# EAGLE design pb-led-matrix (EAGLE 7.2.0)
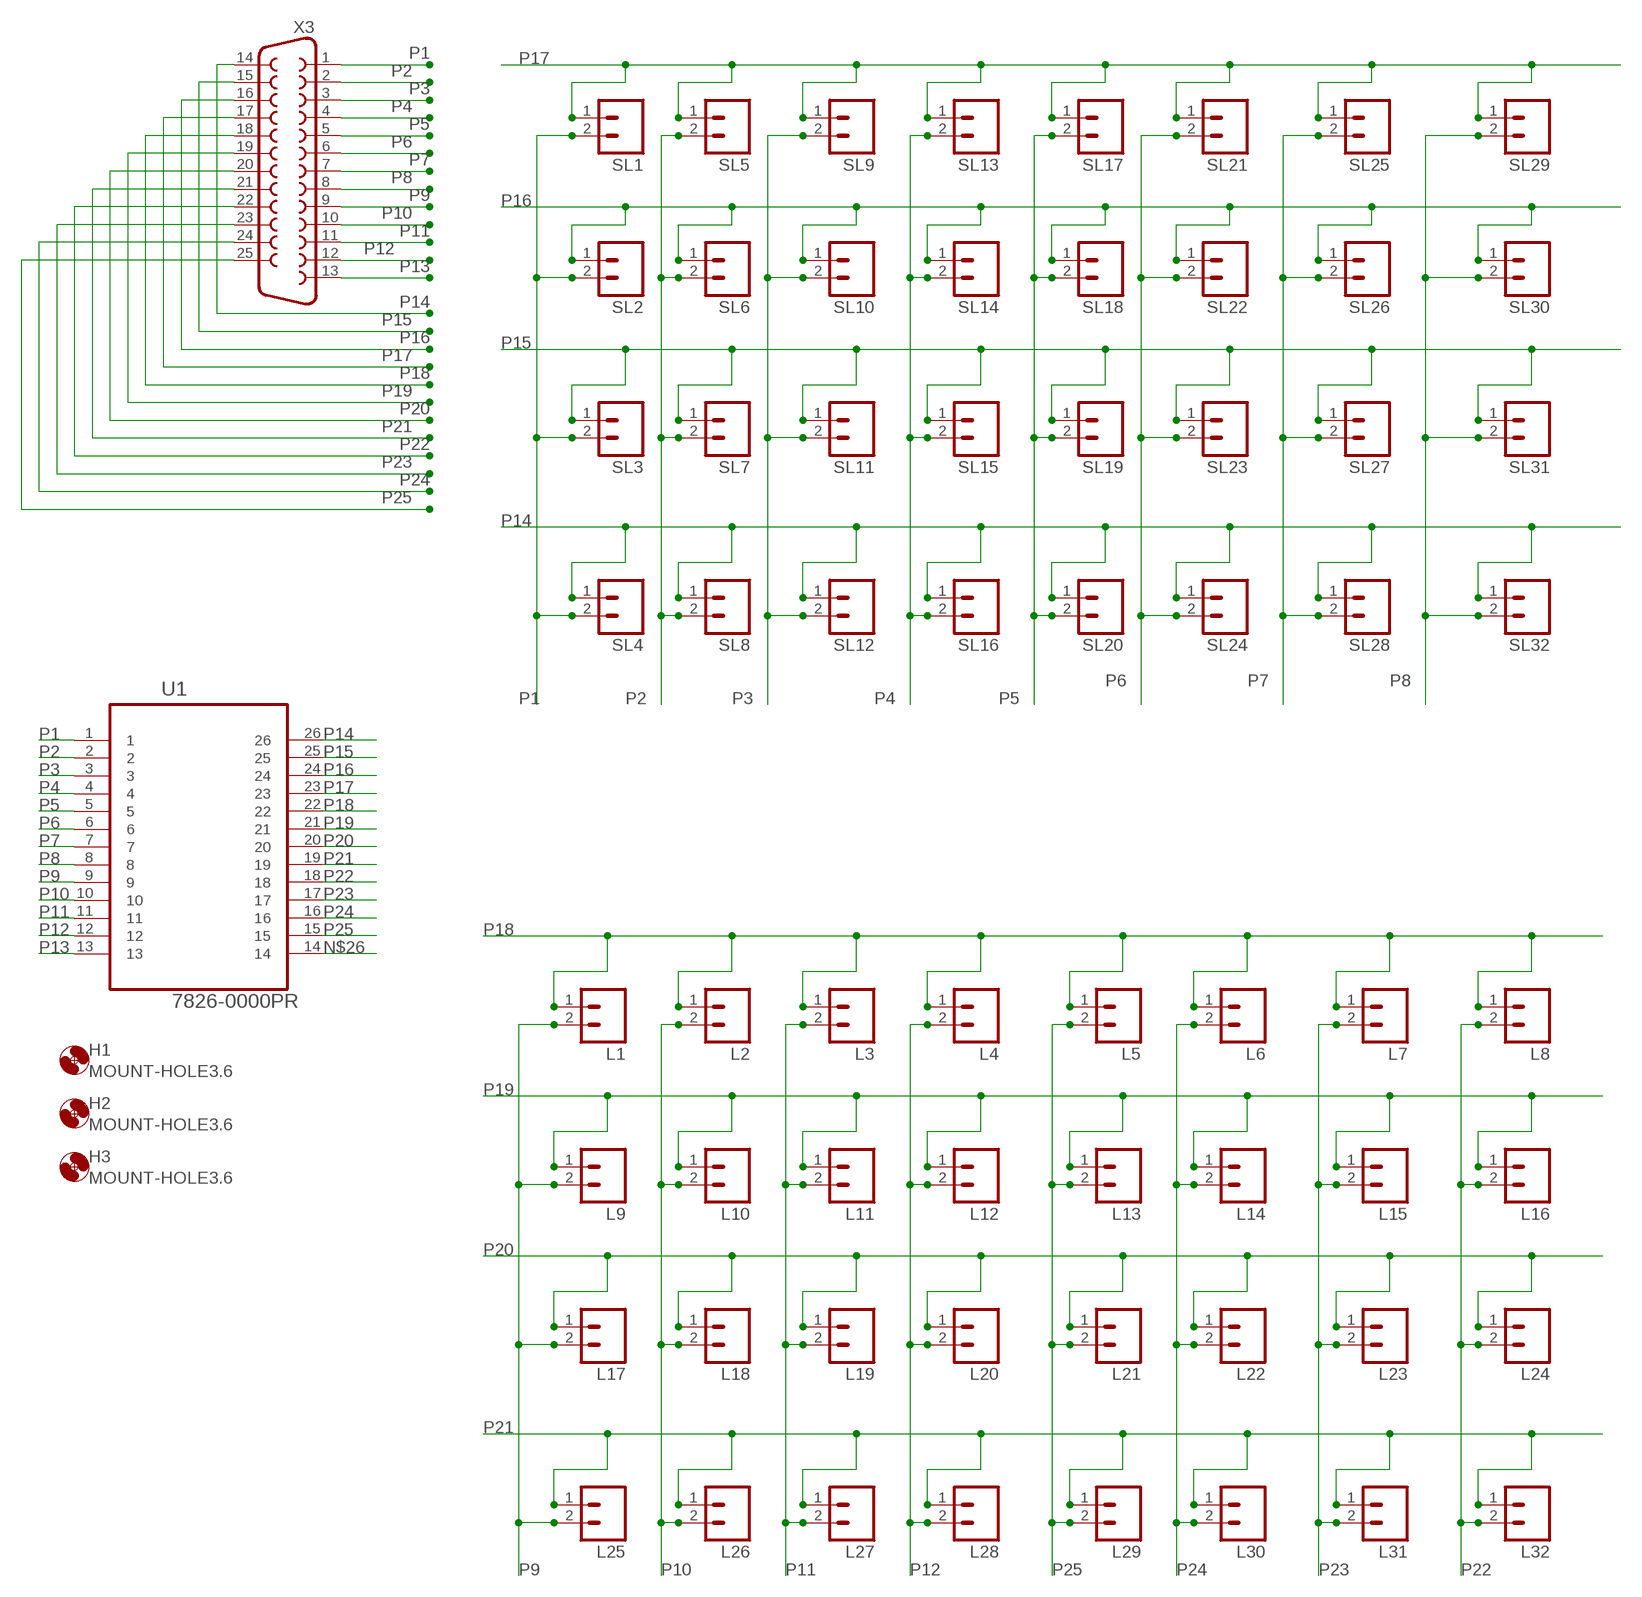
[diagram p0: schematic, sheet 1]

## Parts
H1  MOUNT-HOLE3.6  [3,6]
H2  MOUNT-HOLE3.6  [3,6]
H3  MOUNT-HOLE3.6  [3,6]
L1  M02  [02P]
L2  M02  [02P]
L3  M02  [02P]
L4  M02  [02P]
L5  M02  [02P]
L6  M02  [02P]
L7  M02  [02P]
L8  M02  [02P]
L9  M02  [02P]
L10  M02  [02P]
L11  M02  [02P]
L12  M02  [02P]
L13  M02  [02P]
L14  M02  [02P]
L15  M02  [02P]
L16  M02  [02P]
L17  M02  [02P]
L18  M02  [02P]
L19  M02  [02P]
L20  M02  [02P]
L21  M02  [02P]
L22  M02  [02P]
L23  M02  [02P]
L24  M02  [02P]
L25  M02  [02P]
L26  M02  [02P]
L27  M02  [02P]
L28  M02  [02P]
L29  M02  [02P]
L30  M02  [02P]
L31  M02  [02P]
L32  M02  [02P]
SL1  M02  [02P]
SL2  M02  [02P]
SL3  M02  [02P]
SL4  M02  [02P]
SL5  M02  [02P]
SL6  M02  [02P]
SL7  M02  [02P]
SL8  M02  [02P]
SL9  M02  [02P]
SL10  M02  [02P]
SL11  M02  [02P]
SL12  M02  [02P]
SL13  M02  [02P]
SL14  M02  [02P]
SL15  M02  [02P]
SL16  M02  [02P]
SL17  M02  [02P]
SL18  M02  [02P]
SL19  M02  [02P]
SL20  M02  [02P]
SL21  M02  [02P]
SL22  M02  [02P]
SL23  M02  [02P]
SL24  M02  [02P]
SL25  M02  [02P]
SL26  M02  [02P]
SL27  M02  [02P]
SL28  M02  [02P]
SL29  M02  [02P]
SL30  M02  [02P]
SL31  M02  [02P]
SL32  M02  [02P]
U1  7826-0000PR  [3M_7826-0000PR]
X3  F25VP  [F25VP]

## Nets
N$26: U1.14
P1: SL1.2 SL2.2 SL3.2 SL4.2 U1.1 X3.1
P2: SL5.2 SL6.2 SL7.2 SL8.2 U1.2 X3.2
P3: SL9.2 SL10.2 SL11.2 SL12.2 U1.3 X3.3
P4: SL13.2 SL14.2 SL15.2 SL16.2 U1.4 X3.4
P5: SL17.2 SL18.2 SL19.2 SL20.2 U1.5 X3.5
P6: SL21.2 SL22.2 SL23.2 SL24.2 U1.6 X3.6
P7: SL25.2 SL26.2 SL27.2 SL28.2 U1.7 X3.7
P8: SL29.2 SL30.2 SL31.2 SL32.2 U1.8 X3.8
P9: L1.2 L9.2 L17.2 L25.2 U1.9 X3.9
P10: L2.2 L10.2 L18.2 L26.2 U1.10 X3.10
P11: L3.2 L11.2 L19.2 L27.2 U1.11 X3.11
P12: L4.2 L12.2 L20.2 L28.2 U1.12 X3.12
P13: U1.13 X3.13
P14: SL4.1 SL8.1 SL12.1 SL16.1 SL20.1 SL24.1 SL28.1 SL32.1 U1.26 X3.14
P15: SL3.1 SL7.1 SL11.1 SL15.1 SL19.1 SL23.1 SL27.1 SL31.1 U1.25 X3.15
P16: SL2.1 SL6.1 SL10.1 SL14.1 SL18.1 SL22.1 SL26.1 SL30.1 U1.24 X3.16
P17: SL1.1 SL5.1 SL9.1 SL13.1 SL17.1 SL21.1 SL25.1 SL29.1 U1.23 X3.17
P18: L1.1 L2.1 L3.1 L4.1 L5.1 L6.1 L7.1 L8.1 U1.22 X3.18
P19: L9.1 L10.1 L11.1 L12.1 L13.1 L14.1 L15.1 L16.1 U1.21 X3.19
P20: L17.1 L18.1 L19.1 L20.1 L21.1 L22.1 L23.1 L24.1 U1.20 X3.20
P21: L25.1 L26.1 L27.1 L28.1 L29.1 L30.1 L31.1 L32.1 U1.19 X3.21
P22: L8.2 L16.2 L24.2 L32.2 U1.18 X3.22
P23: L7.2 L15.2 L23.2 L31.2 U1.17 X3.23
P24: L6.2 L14.2 L22.2 L30.2 U1.16 X3.24
P25: L5.2 L13.2 L21.2 L29.2 U1.15 X3.25

## Library data of the parts
H1-H3 = holes:MOUNT-HOLE: MOUNTING HOLE with drill center marker
L1-L32 SL1-SL32 = con-amp-quick:M02: AMP QUICK CONNECTOR; OC_FARNELL: unknown; OC_NEWARK: unknown
U1 = 3M_By_element14_Batch_1:7826-0000PR: 26/PCB/2ROW/2.8MM; MPN: 7826-0000PR; OC_FARNELL: 9138757; OC_NEWARK: 18M8272; PACKAGE: 26/PCB/2ROW/2.8MM; SUPPLIER: 3M
X3 = SparkFun-Connectors:F25: 25 Pin male connector. PCB edge mount for regular PCB thicknesses. This connector will connect directly to the back of a PC parallel port or through a normal DB25 extension cable (M/F). SKU: PRT-08287

## Board
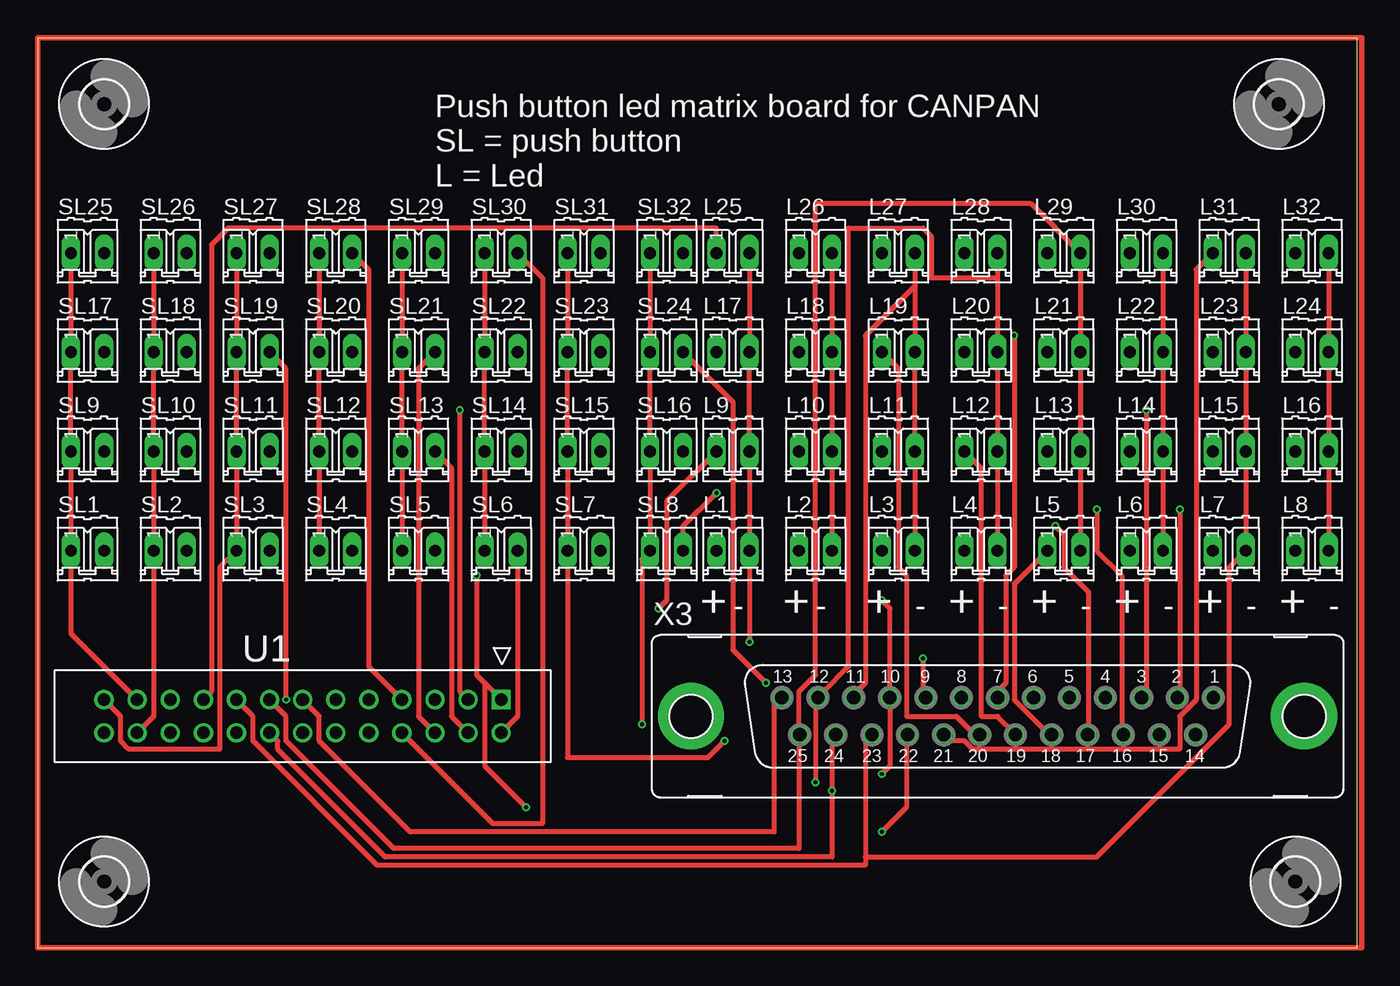
[diagram p1: board, top side]
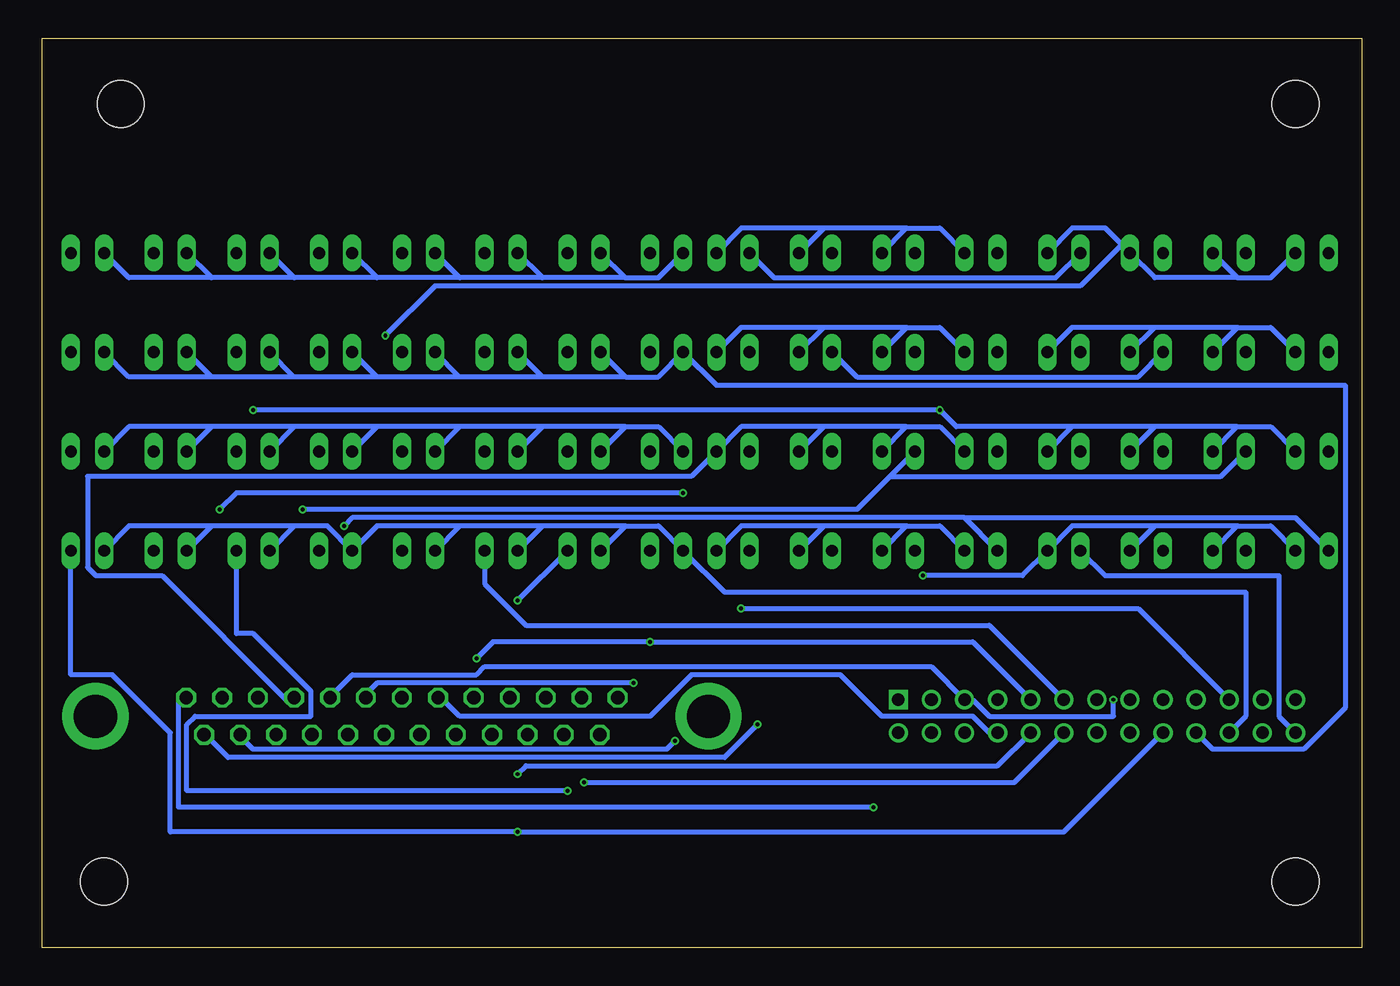
[diagram p2: board, bottom side, seen from below]

Size 101.27 x 69.84 mm. Coordinates in mm from the lower left corner, seen from the top.
Outline: 0,0 101.27,0 101.27,69.84 0,69.84 0,0
Copper layers (1*16): Top 0.035mm / dielectric 1.5mm / Bottom 0.035mm
Design rules "Elecrow_2-layer_eagle_rule *": minimum track width 15mil, minimum drill 12mil, track to track 6mil, track to pad 6mil, pad to pad 6mil, via to via 6mil, smd to smd 0mil, copper to edge 10mil, drill to drill 10mil, minimum pad ring 10mil, minimum via ring 6mil, stop-mask expansion 2mil, vias tented up to drill 100mil, thermal gap 10mil

### Footprints (pad centres in the part's own frame; a part is rotated, then mirrored left to right if it is on the bottom)
3,6 = hole 3.6: 0,0
02P = drill 0.914 long: 1 -1.27,0; 2 1.27,0
3M_7826-0000PR = drill 0.965 square: 1 0,2.54 | drill 0.965: 2 0,0; 3 -2.54,2.54; 4 -2.54,0; 5 -5.08,2.54; 6 -5.08,0; 7 -7.62,2.54; 8 -7.62,0; 9 -10.16,2.54; 10 -10.16,0; 11 -12.7,2.54; 12 -12.7,0; 13 -15.24,2.54; 14 -15.24,0; 15 -17.78,2.54; 16 -17.78,0; 17 -20.32,2.54; 18 -20.32,0; 19 -22.86,2.54; 20 -22.86,0; 21 -25.4,2.54; 22 -25.4,0; 23 -27.94,2.54; 24 -27.94,0; 25 -30.48,2.54; 26 -30.48,0
F25VP = drill 1.016 octagon: 1 16.561,1.422; 2 13.792,1.422; 3 11.049,1.422; 4 8.28,1.422; 5 5.512,1.422; 6 2.769,1.422; 7 0,1.422; 8 -2.769,1.422; 9 -5.512,1.422; 10 -8.28,1.422; 11 -11.049,1.422; 12 -13.792,1.422; 13 -16.561,1.422; 14 15.189,-1.422; 15 12.421,-1.422; 16 9.652,-1.422; 17 6.909,-1.422; 18 4.14,-1.422; 19 1.372,-1.422; 20 -1.372,-1.422; 21 -4.14,-1.422; 22 -6.909,-1.422; 23 -9.652,-1.422; 24 -12.421,-1.422; 25 -15.189,-1.422 | drill 3.302 pad 5.08: G1 -23.52,0; G2 23.52,0

### Placement (x,y rotation side)
H1  96.52,5.08 0 top
H2  5.08,64.77 0 top
H3  95.25,64.77 0 top
H4  MOUNT-HOLE3.6  [3,6]  5.08,5.08 0 top
L1  53.34,30.48 0 top
L2  59.69,30.48 0 top
L3  66.04,30.48 0 top
L4  72.39,30.48 0 top
L5  78.74,30.48 0 top
L6  85.09,30.48 0 top
L7  91.44,30.48 0 top
L8  97.79,30.48 0 top
L9  53.34,38.1 0 top
L10  59.69,38.1 0 top
L11  66.04,38.1 0 top
L12  72.39,38.1 0 top
L13  78.74,38.1 0 top
L14  85.09,38.1 0 top
L15  91.44,38.1 0 top
L16  97.79,38.1 0 top
L17  53.34,45.72 0 top
L18  59.69,45.72 0 top
L19  66.04,45.72 0 top
L20  72.39,45.72 0 top
L21  78.74,45.72 0 top
L22  85.09,45.72 0 top
L23  91.44,45.72 0 top
L24  97.79,45.72 0 top
L25  53.34,53.34 0 top
L26  59.69,53.34 0 top
L27  66.04,53.34 0 top
L28  72.39,53.34 0 top
L29  78.74,53.34 0 top
L30  85.09,53.34 0 top
L31  91.44,53.34 0 top
L32  97.79,53.34 0 top
SL1  3.81,30.48 0 top
SL2  10.16,30.48 0 top
SL3  16.51,30.48 0 top
SL4  22.86,30.48 0 top
SL5  29.21,30.48 0 top
SL6  35.56,30.48 0 top
SL7  41.91,30.48 0 top
SL8  48.26,30.48 0 top
SL9  3.81,38.1 0 top
SL10  10.16,38.1 0 top
SL11  16.51,38.1 0 top
SL12  22.86,38.1 0 top
SL13  29.21,38.1 0 top
SL14  35.56,38.1 0 top
SL15  41.91,38.1 0 top
SL16  48.26,38.1 0 top
SL17  3.81,45.72 0 top
SL18  10.16,45.72 0 top
SL19  16.51,45.72 0 top
SL20  22.86,45.72 0 top
SL21  29.21,45.72 0 top
SL22  35.56,45.72 0 top
SL23  41.91,45.72 0 top
SL24  48.26,45.72 0 top
SL25  3.81,53.34 0 top
SL26  10.16,53.34 0 top
SL27  16.51,53.34 0 top
SL28  22.86,53.34 0 top
SL29  29.21,53.34 0 top
SL30  35.56,53.34 0 top
SL31  41.91,53.34 0 top
SL32  48.26,53.34 0 top
U1  35.56,16.51 0 top
X3  73.66,17.78 0 top

### Tracks (layer width: path | path; a pad name or v marks a point on that pad's centre or on a via)
N$1
  Top 0.406: 0,69.85 101.6,69.85 101.6,0 0,0 0,69.85
P1  (via drill 0.3)
  Top 0.381: 34.29,20.32 33.66,20.95 v33.66,28.57 | 34.29,20.32 U1.1 | v37.47,10.79 34.29,13.97 34.29,20.32
  Bottom 0.381: SL1.2 6.99,32.38 9.53,32.38 | SL2.2 9.53,32.38 | 15.88,32.38 SL3.2 | 9.53,32.38 15.88,32.38 | 15.88,32.38 22.23,32.38 SL4.2 26.04,28.57 v33.66,28.57 | v37.47,10.79 90.81,10.79 90.81,19.05 X3.1
P2  (via drill 0.3)
  Top 0.381: U1.2 36.83,17.78 SL6.2 | v87.63,33.66 87.63,19.68 X3.2 | v52.07,34.92 49.53,32.38 SL8.2
  Bottom 0.381: SL5.2 32.38,32.38 34.92,32.38 | SL6.2 34.92,32.38 | 41.27,32.38 SL7.2 | 34.92,32.38 41.27,32.38 | SL8.2 47.62,32.38 41.27,32.38 | v87.63,33.66 86.36,34.92 v52.07,34.92
P3  (via drill 0.3)
  Top 0.381: U1.3 32.38,19.68 v32.38,41.27 | v85.09,41.27 85.09,19.68 X3.3
  Bottom 0.381: SL9.2 6.99,40.01 9.53,40.01 | SL10.2 9.53,40.01 | 15.88,40.01 SL11.2 | 9.53,40.01 15.88,40.01 | 22.23,40.01 SL12.2 | 15.88,40.01 22.23,40.01 | 22.23,40.01 31.11,40.01 v32.38,41.27 v85.09,41.27
P4
  Top 0.381: U1.4 31.75,17.78 31.75,36.83 SL13.2
  Bottom 0.381: SL13.2 32.38,40.01 34.92,40.01 | SL14.2 34.92,40.01 | 41.27,40.01 SL15.2 | 34.92,40.01 41.27,40.01 | 41.27,40.01 47.62,40.01 SL16.2 51.44,36.2 97.79,36.2 97.79,29.21 97.16,28.57 92.08,28.57 82.55,19.05 X3.4
P5  (via drill 0.3)
  Top 0.381: SL19.2 19.05,44.45 v19.05,19.05
  Bottom 0.381: SL17.2 6.99,47.62 9.53,47.62 | SL18.2 9.53,47.62 | 15.88,47.62 SL19.2 | 9.53,47.62 15.88,47.62 | SL20.2 22.23,47.62 15.88,47.62 | X3.5 78.74,19.68 77.47,20.95 67.94,20.95 67.31,21.59 33.02,21.59 U1.5 29.84,19.05 28.57,17.78 19.05,17.78 v19.05,19.05
P6  (via drill 0.3)
  Top 0.381: U1.6 29.21,17.78 29.21,44.45 SL21.2 | v55.88,20.32 53.34,22.86 53.34,41.91 SL24.2
  Bottom 0.381: SL21.2 32.38,47.62 34.92,47.62 | SL22.2 34.92,47.62 | 41.27,47.62 SL23.2 | 34.92,47.62 41.27,47.62 | SL24.2 47.62,47.62 41.27,47.62 | v55.88,20.32 75.56,20.32 76.2,19.68 X3.6
P7  (via drill 0.3)
  Top 0.381: U1.7 25.4,21.59 25.4,52.07 SL28.2 | v74.93,46.99 74.93,29.21 74.3,28.57 74.3,20.32 73.66,19.68 X3.7
  Bottom 0.381: SL25.2 6.99,51.44 9.53,51.44 | SL26.2 9.53,51.44 | 9.53,51.44 15.88,51.44 SL27.2 18.41,53.98 | SL28.2 22.23,55.24 19.68,55.24 18.41,53.98 | v74.93,46.99 71.12,50.8 21.59,50.8 18.41,53.98
P8
  Top 0.381: U1.8 34.92,9.53 38.73,9.53 38.73,51.44 SL30.2
  Bottom 0.381: SL29.2 32.38,55.24 34.92,55.24 | SL30.2 34.92,55.24 | 41.27,55.24 SL31.2 | 34.92,55.24 41.27,55.24 | SL32.2 47.62,55.24 41.27,55.24 | U1.8 28.57,16.51 29.84,17.78 36.83,17.78 40.01,20.95 51.44,20.95 54.61,17.78 69.22,17.78 70.48,19.05 X3.8
P9  (via drill 0.3)
  Top 0.381: L25.2 L17.2 L9.2 L1.2 v54.61,23.5 | v67.94,22.23 67.94,19.68 X3.9
  Bottom 0.381: U1.9 29.84,23.5 v54.61,23.5 66.67,23.5 v67.94,22.23
P10  (via drill 0.3)
  Top 0.381: L2.2 L10.2 L18.2 L26.2 | v64.77,13.34 65.41,13.97 65.41,19.05 X3.10 65.41,19.68 65.41,26.04 v64.77,26.67
  Bottom 0.381: U1.10 27.94,13.97 64.14,13.97 v64.77,13.34 | v64.77,26.67 L2.2
P11
  Top 0.381: L27.2 67.31,50.8 | 67.31,50.8 L19.2 L11.2 L3.2 | 67.31,50.8 63.5,46.99 63.5,20.32 62.87,19.68 X3.11
  Bottom 0.381: U1.11 28.57,24.77 64.14,24.77 67.31,27.94 L3.2
P12  (via drill 0.3)
  Top 0.381: L4.2 L12.2 L20.2 73.66,51.44 | L28.2 73.66,51.44 | v59.69,12.7 59.69,19.05 X3.12 60.33,19.68 62.23,21.59 62.23,55.24 67.94,55.24 68.58,54.61 68.58,51.44 73.66,51.44
  Bottom 0.381: U1.12 26.67,12.7 v59.69,12.7
P13
  Top 0.381: U1.13 21.59,17.78 21.59,15.88 28.57,8.89 56.52,8.89 56.52,19.05 X3.13
P14  (via drill 0.3)
  Top 0.381: SL28.1 SL20.1 SL12.1 SL4.1 | SL32.1 SL24.1 SL16.1 SL8.1 46.35,29.84 v46.35,17.14
  Bottom 0.381: U1.26 6.35,17.78 6.35,28.57 19.68,28.57 SL4.1 | v46.35,17.14 48.9,14.61 87,14.61 88.27,15.88 X3.14 | SL28.1 23.5,51.44 45.09,51.44 SL32.1
P15  (via drill 0.3)
  Top 0.381: SL27.1 SL19.1 SL11.1 SL3.1 13.97,29.21 13.97,15.24 6.99,15.24 6.35,15.88 6.35,17.78 U1.25 | SL31.1 SL23.1 SL15.1 SL7.1 40.64,14.61 51.44,14.61 v52.7,15.88
  Bottom 0.381: v52.7,15.88 53.34,15.24 85.09,15.24 85.72,15.88 X3.15 | SL19.1 17.14,43.81 38.73,43.81 SL23.1
P16  (via drill 0.3)
  Top 0.381: SL26.1 SL18.1 SL10.1 SL2.1 8.89,17.78 U1.24 | SL30.1 SL22.1 SL14.1 SL6.1 | v81.28,33.66 81.28,30.48 83.19,28.57 83.19,16.51 X3.16
  Bottom 0.381: v81.28,33.66 38.73,33.66 36.2,36.2 | SL14.1 36.2,36.2 | SL10.1 10.79,36.2 36.2,36.2
P17  (via drill 0.3)
  Top 0.381: SL25.1 SL17.1 SL9.1 SL1.1 2.54,24.13 U1.23 | SL29.1 SL21.1 SL13.1 SL5.1 | v78.11,32.38 78.74,31.75 78.74,29.21 80.64,27.3 80.64,16.51 X3.17
  Bottom 0.381: v78.11,32.38 77.47,33.02 30.48,33.02 | SL5.1 30.48,33.02 | SL1.1 5.08,33.02 30.48,33.02
P18
  Top 0.381: L5.1 74.93,27.94 74.93,19.05 77.47,16.51 X3.18
  Bottom 0.381: 56.52,32.38 53.98,32.38 L1.1 48.9,27.3 8.89,27.3 8.89,17.78 U1.22 | L2.1 56.52,32.38 | 62.87,32.38 L3.1 | 56.52,32.38 62.87,32.38 | 69.22,32.38 L4.1 | 62.87,32.38 69.22,32.38 | 69.22,32.38 75.56,32.38 L5.1 79.38,32.38 81.92,32.38 | 81.92,32.38 L6.1 | 88.27,32.38 L7.1 | 81.92,32.38 88.27,32.38 | L8.1 94.61,32.38 88.27,32.38
P19  (via drill 0.3)
  Top 0.381: v47.62,26.04 48.26,26.67 48.26,34.29 L9.1 | L12.1 72.39,36.83 72.39,17.78 73.66,17.78 74.93,16.51 X3.19
  Bottom 0.381: L9.1 53.98,40.01 56.52,40.01 | L10.1 56.52,40.01 | 62.87,40.01 L11.1 | 56.52,40.01 62.87,40.01 | 69.22,40.01 L12.1 | 62.87,40.01 69.22,40.01 | 75.56,40.01 L13.1 | 69.22,40.01 75.56,40.01 | 81.92,40.01 L14.1 | 75.56,40.01 81.92,40.01 | 88.27,40.01 L15.1 | 81.92,40.01 88.27,40.01 | L16.1 94.61,40.01 88.27,40.01 | U1.21 17.14,26.04 v47.62,26.04
P20
  Top 0.381: L19.1 66.04,44.45 66.04,29.21 66.67,28.57 66.67,17.78 70.48,17.78 71.75,16.51 X3.20
  Bottom 0.381: 56.52,43.81 53.98,43.81 L17.1 49.53,43.18 1.27,43.18 1.27,18.41 4.45,15.24 11.43,15.24 U1.20 | L18.1 56.52,43.81 | 62.87,43.81 L19.1 | 56.52,43.81 62.87,43.81 | 69.22,43.81 L20.1 | 62.87,43.81 69.22,43.81 | 75.56,43.81 L21.1 | 69.22,43.81 75.56,43.81 | 81.92,43.81 L22.1 | 75.56,43.81 81.92,43.81 | 88.27,43.81 L23.1 | 81.92,43.81 88.27,43.81 | L24.1 94.61,43.81 88.27,43.81
P21
  Top 0.381: U1.19 13.34,19.68 13.34,53.98 14.61,55.24 52.07,55.24 L25.1 | L31.1 88.9,52.07 88.9,19.05 87.63,17.78 87.63,15.24 71.75,15.24 71.12,15.88 69.85,15.88 X3.21
  Bottom 0.381: L25.1 53.98,51.44 56.52,51.44 | L26.1 56.52,51.44 | 62.87,51.44 L27.1 | 56.52,51.44 62.87,51.44 | 69.22,51.44 L28.1 | 62.87,51.44 69.22,51.44 | 75.56,51.44 L29.1 | 69.22,51.44 75.56,51.44 | 81.92,51.44 L30.1 | 75.56,51.44 81.92,51.44 | 88.27,51.44 L31.1 | 81.92,51.44 88.27,51.44 | L32.1 94.61,51.44 88.27,51.44
P22  (via drill 0.3)
  Top 0.381: L8.2 L16.2 L24.2 L32.2 | v64.77,8.89 66.67,10.79 66.67,15.88 X3.22
  Bottom 0.381: U1.18 22.86,8.89 v64.77,8.89 91.44,8.89 91.44,16.51 95.89,20.95 99.06,20.95 L8.2
P23
  Top 0.381: L31.2 L23.2 L15.2 L7.2 91.44,29.21 91.44,17.14 81.28,6.99 63.5,6.99 | U1.17 16.51,17.78 16.51,15.88 26.04,6.35 63.5,6.35 63.5,6.99 | 63.5,6.99 63.5,15.88 X3.23
P24  (via drill 0.3)
  Top 0.381: L6.2 L14.2 L22.2 L30.2 | U1.16 18.41,15.88 18.41,15.24 26.67,6.99 60.96,6.99 v60.96,12.06 60.96,15.88 X3.24
  Bottom 0.381: L6.2 86.36,24.13 85.09,24.13 80.64,19.68 80.64,17.78 89.53,17.78 90.17,17.14 90.17,12.06 v60.96,12.06
P25
  Top 0.381: L5.2 L13.2 L21.2 L29.2 76.2,57.15 59.69,57.15 59.69,20.95 58.42,19.68 58.42,16.51 X3.25 58.42,15.88 58.42,7.62 27.3,7.62 19.05,15.88 19.05,17.78 U1.15

### Text on the board
tNames: Push button led matrix board for CANPAN / SL = push button / L = Led | + | - | + | - | + | - | + | - | + | - | + | - | + | - | + | -